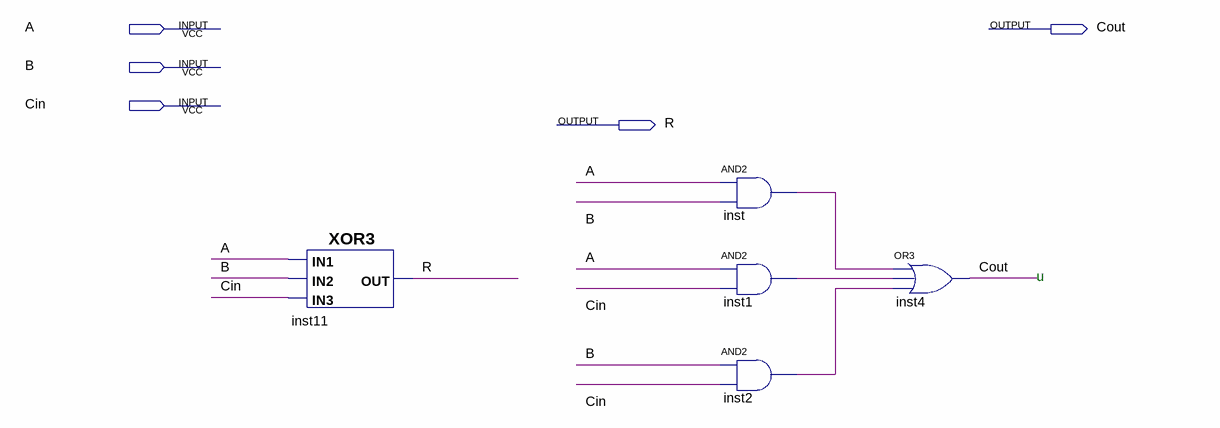
[diagram p0: schematic sheet]
// Quartus schematic OneBitAdder.bdf as structural Verilog: 5 symbols, 5 pins
module OneBitAdder (
  input  A,
  input  B,
  input  Cin,
  output Cout,
  output R
);

  wire inst1_out, inst2_out, inst_out;

  XOR3 inst11 (.IN3(Cin), .IN1(A), .IN2(B), .OUT(R));
  and inst (inst_out, A, B);
  and inst1 (inst1_out, A, Cin);
  and inst2 (inst2_out, B, Cin);
  or inst4 (Cout, inst_out, inst1_out, inst2_out);

  // Notes on the sheet:
  //   u
endmodule
